# Altium project 1437_InclinometerPCB.PrjPCB
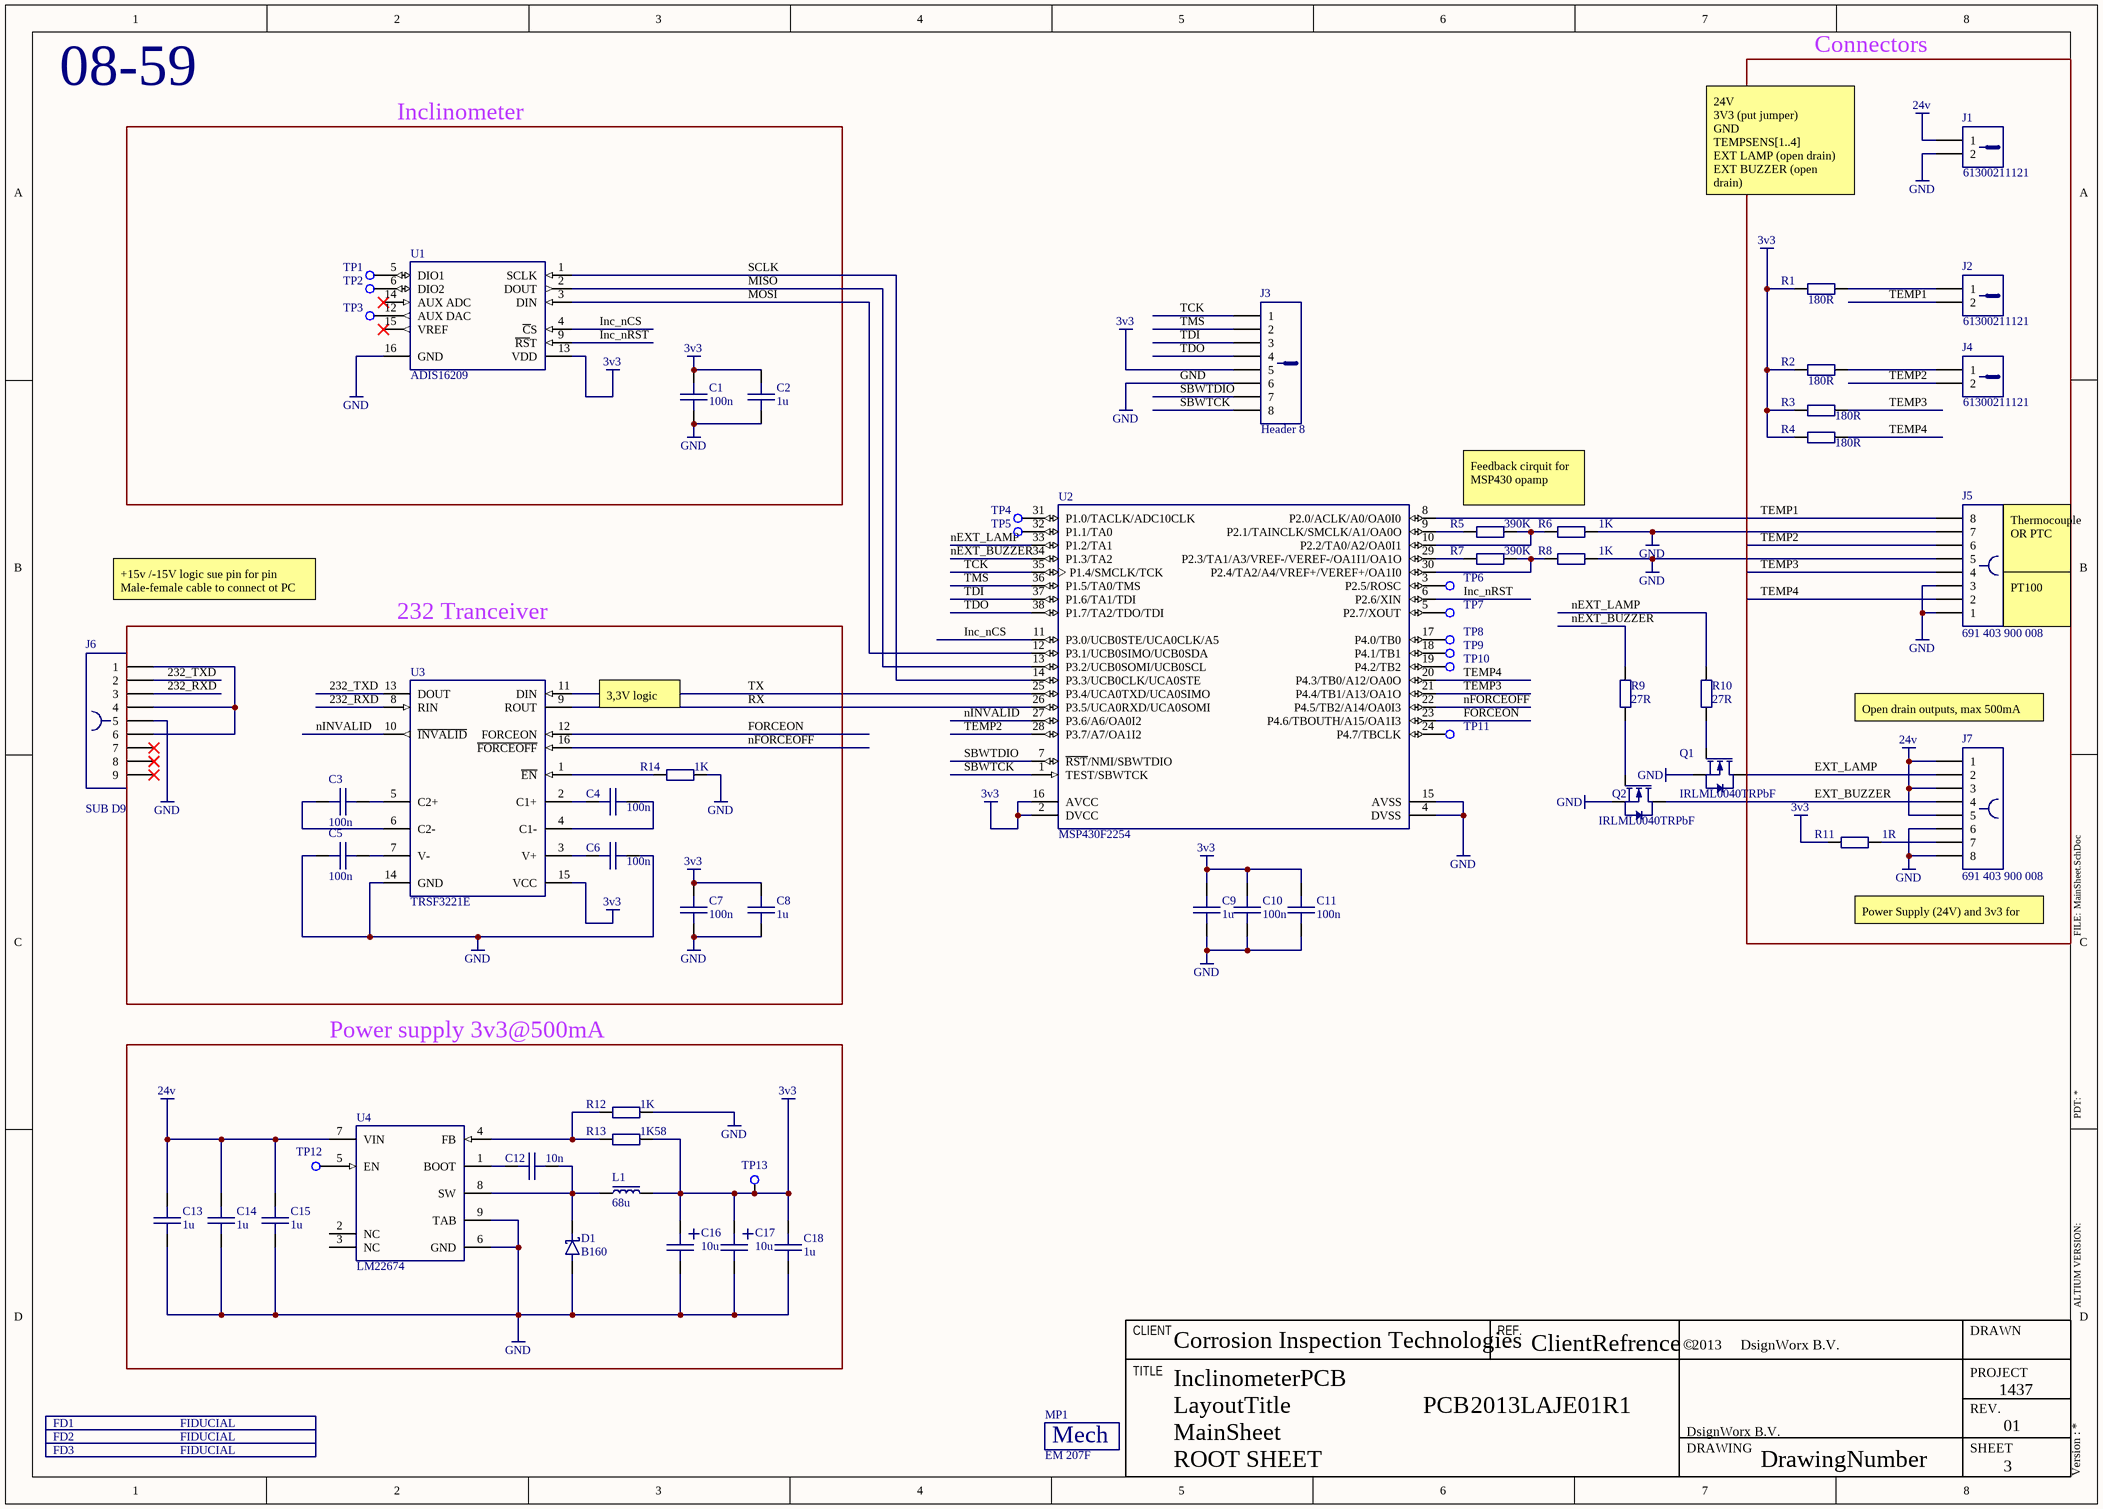
[diagram p0: MainSheet.SchDoc]
Client: Corrosion Inspection Technologies; ClientAddress-1: Amazone 194; ClientAddress-2: 3315WK; ClientAddress-3: DORDRECHT; ClientAddress-4: The Netherlands; ClientRefrence: ClientRefrence; DateApproved: DateApproved; DateChecked: DateChecked; DrawingNumber: DrawingNumber; EngApproved: EngApproved; EngChecked: EngChecked; EngProj: LAJE; GlobalRevision: 0; LayoutNr: 2013LAJE01R1; LayoutTitle: LayoutTitle; LayoutType: LayoutType; ProjName: InclinometerPCB; ProjNr: 1437; Year: 2013
1 sheet, 65 parts. Net scope: global (net labels, ports and power ports of the same name join across sheets).
Board file: InclinometerPCB.PcbDoc

## Sheet MainSheet.SchDoc
size A3; GlobalRevision: 01; DocumentNumber: 3; SheetNumber: 3; SheetTotal: 3; Eng: LAJE; DocumentType: ROOT SHEET; DocumentTitle: MainSheet; ProjNr: 1437

### Parts
?  (no value)  (graphical)
C1  Value1: 100n  [CAPC2012X88N]  (hidden comment: CAP)
C2  Value1: 1u  [CAPC2012X125N]  (hidden comment: CAP)
C3  Value1: 100n  [CAPC2012X88N]  (hidden comment: CAP)
C4  Value1: 100n  [CAPC2012X88N]  (hidden comment: CAP)
C5  Value1: 100n  [CAPC2012X88N]  (hidden comment: CAP)
C6  Value1: 100n  [CAPC2012X88N]  (hidden comment: CAP)
C7  Value1: 100n  [CAPC2012X88N]  (hidden comment: CAP)
C8  Value1: 1u  [CAPC2012X125N]  (hidden comment: CAP)
C9  Value1: 1u  [CAPC2012X125N]  (hidden comment: CAP)
C10  Value1: 100n  [CAPC2012X88N]  (hidden comment: CAP)
C11  Value1: 100n  [CAPC2012X88N]  (hidden comment: CAP)
C12  Value1: 10n  [CAPC2012X88N]  (hidden comment: CAP)
C13  Value1: 1u  [CAPC2012X125N]  (hidden comment: CAP)
C14  Value1: 1u  [CAPC2012X125N]  (hidden comment: CAP)
C15  Value1: 1u  [CAPC2012X125N]  (hidden comment: CAP)
C16  Value1: 10u  [CAPAE430X560N]  (hidden comment: CAP_POL)
C17  Value1: 10u  [CAPAE430X560N]  (hidden comment: CAP_POL)
C18  Value1: 1u  [CAPC2012X125N]  (hidden comment: CAP)
D1  Value1: B160  [DIOM5226X230N]  (hidden comment: DIO_SCHOTTKY)
FD1  Value1: FIDUCIAL  [FID100X200]  (hidden comment: MSC_FD)  (no BOM)
FD2  Value1: FIDUCIAL  [FID100X200]  (hidden comment: MSC_FD)  (no BOM)
FD3  Value1: FIDUCIAL  [FID100X200]  (hidden comment: MSC_FD)  (no BOM)
J1  Value1: 61300211121  [HDRV2W64P254_1X2_508X254X854P]  (hidden comment: CN_1X2M)
J2  Value1: 61300211121  [HDRV2W64P254_1X2_508X254X854P]  (hidden comment: CN_1X2M)
J3  Value1: Header 8  [CN_WURTH_613 00811121]  (hidden comment: CN_1X8M)
J4  Value1: 61300211121  [HDRV2W64P254_1X2_508X254X854P]  (hidden comment: CN_1X2M)
J5  Value1: 691 403 900 008  [CN_WURTH_691403900008]  (hidden comment: CN_1X8F)
J6  Value1: SUB D9  [DB_RA_R-9]  (hidden comment: CN_1X9F)
J7  Value1: 691 403 900 008  [CN_WURTH_691403900008]  (hidden comment: CN_1X8F)
L1  Value1: 68u  [IND_BOURNS_SDR0805]  (hidden comment: IND_CORE)
MP1  Value1: EM 207F  [MCH_BOPLA_EM207]  (hidden comment: MCH_MECHGENERIC)
Q1  Value1: IRLML0040TRPbF  [SOT95P237X112-3N]  (hidden comment: TRS_FETN_123)
Q2  Value1: IRLML0040TRPbF  [SOT95P237X112-3N]  (hidden comment: TRS_FETN_123)
R1  Value1: 180R  [RESC2012X60N]  (hidden comment: RES)
R2  Value1: 180R  [RESC2012X60N]  (hidden comment: RES)
R3  Value1: 180R  [RESC2012X60N]  (hidden comment: RES)
R4  Value1: 180R  [RESC2012X60N]  (hidden comment: RES)
R5  Value1: 390K  [RESC2012X60N]  (hidden comment: RES)
R6  Value1: 1K  [RESC2012X60N]  (hidden comment: RES)
R7  Value1: 390K  [RESC2012X60N]  (hidden comment: RES)
R8  Value1: 1K  [RESC2012X60N]  (hidden comment: RES)
R9  Value1: 27R  [RESC2012X60N]  (hidden comment: RES)
R10  Value1: 27R  [RESC2012X60N]  (hidden comment: RES)
R11  Value1: 1R  [RESC2012X60N]  (hidden comment: RES)
R12  Value1: 1K  [RESC2012X60N]  (hidden comment: RES)
R13  Value1: 1K58  [RESC2012X60N]  (hidden comment: RES)
R14  Value1: 1K  [RESC2012X60N]  (hidden comment: RES)
TP1  MSC_TP  [MSC_TP_THT1MM]  (value not drawn)  (no BOM)
TP2  MSC_TP  [MSC_TP_THT1MM]  (value not drawn)  (no BOM)
TP3  MSC_TP  [MSC_TP_THT1MM]  (value not drawn)  (no BOM)
TP4  MSC_TP  [MSC_TP_THT1MM]  (value not drawn)  (no BOM)
TP5  MSC_TP  [MSC_TP_THT1MM]  (value not drawn)  (no BOM)
TP6  MSC_TP  [MSC_TP_THT1MM]  (value not drawn)  (no BOM)
TP7  MSC_TP  [MSC_TP_THT1MM]  (value not drawn)  (no BOM)
TP8  MSC_TP  [MSC_TP_THT1MM]  (value not drawn)  (no BOM)
TP9  MSC_TP  [MSC_TP_THT1MM]  (value not drawn)  (no BOM)
TP10  MSC_TP  [MSC_TP_THT1MM]  (value not drawn)  (no BOM)
TP11  MSC_TP  [MSC_TP_THT1MM]  (value not drawn)  (no BOM)
TP12  MSC_TP  [MSC_TP_THT1MM]  (value not drawn)  (no BOM)
TP13  MSC_TP  [MSC_TP_THT1MM]  (value not drawn)  (no BOM)
U1  Value1: ADIS16209  [IC_ANALOG_ADIS16209]  (hidden comment: IC_ANALOG_ADIS16209)
U2  Value1: MSP430F2254  [SOP65P810X120-38N]  (hidden comment: IC_TI-MSP430F22X4-DA38)
U3  Value1: TRSF3221E  [SOP65P780X200-16L]  (hidden comment: IC_TI_TRSF3221E)
U4  Value1: LM22674  [SOIC127P600X168-9N]  (hidden comment: IC_TI_LM22674MR)

### Blocks framed on the sheet
Connectors: J1 J2 J4 J5 J7 R1-R4 R11
Inclinometer: C1 C2 TP1-TP3 U1
232 Tranceiver: C3-C8 J6 R14 U3
Power supply 3v3@500mA: C12-C18 D1 L1 R12 R13 TP12 TP13 U4

### Nets
3v3: C1.2 C2.2 C7.2 C8.2 C9.2 C10.2 C11.2 C16.1 C17.1 C18.2 J3.5 L1.2 R1.1 R2.1 R3.1 R4.1 R11.1 R13.1 TP13.1 U1.13(VDD) U2.2(DVCC) U2.16(AVCC) U3.15(VCC)
24v: C13.2 C14.2 C15.2 J1.1 J7.1 J7.3 J7.5 U4.7(VIN)
GND: C1.1 C2.1 C5.1 C6.2 C7.1 C8.1 C9.1 C10.1 C11.1 C13.1 C14.1 C15.1 C16.2 C17.2 C18.1 D1.2(A) J1.2 J3.6 J5.1 J5.3 J5.5 J5.7 J6.5 J7.6 J7.8 Q1.2(S) Q2.2(S) R6.2 R8.2 R12.2 R14.2 U1.16(GND) U2.4(DVSS) U2.15(AVSS) U3.14(GND) U4.6(GND) U4.9(TAB)
232_RXD: J6.3 U3.8(RIN)
232_TXD: J6.2 U3.13(DOUT)
EXT_BUZZER: J7.4 Q2.3(D)
EXT_LAMP: J7.2 Q1.3(D)
FORCEON: U2.23(P4.6/TBOUTH/A15/OA1I3) U3.12(FORCEON)
Inc_nCS: U1.4(~{C}S) U2.11(P3.0/UCB0STE/UCA0CLK/A5)
Inc_nRST: U1.9(~{RS}T) U2.6(P2.6/XIN)
MISO: U1.2(DOUT) U2.13(P3.2/UCB0SOMI/UCB0SCL)
MOSI: U1.3(DIN) U2.12(P3.1/UCB0SIMO/UCB0SDA)
nEXT_BUZZER: R9.2 U2.34(P1.3/TA2)
nEXT_LAMP: R10.2 U2.33(P1.2/TA1)
nFORCEOFF: U2.22(P4.5/TB2/A14/OA0I3) U3.16(~{FORCEOFF})
nINVALID: U2.27(P3.6/A6/OA0I2) U3.10(~{INVALID})
RX: U2.26(P3.5/UCA0RXD/UCA0SOMI) U3.9(ROUT)
SBWTCK: J3.8 U2.1(TEST/SBWTCK)
SBWTDIO: J3.7 U2.7(~{RST}/NMI/SBWTDIO)
SCLK: U1.1(SCLK) U2.14(P3.3/UCB0CLK/UCA0STE)
TCK: J3.1 U2.35(P1.4/SMCLK/TCK)
TDI: J3.3 U2.37(P1.6/TA1/TDI)
TDO: J3.4 U2.38(P1.7/TA2/TDO/TDI)
TEMP1: J2.2 J5.8 U2.8(P2.0/ACLK/A0/OA0I0)
TEMP2: J4.2 J5.6 U2.28(P3.7/A7/OA1I2)
TEMP3: J5.4 R3.2 U2.21(P4.4/TB1/A13/OA1O)
TEMP4: J5.2 R4.2 U2.20(P4.3/TB0/A12/OA0O)
TMS: J3.2 U2.36(P1.5/TA0/TMS)
TX: U2.25(P3.4/UCA0TXD/UCA0SIMO) U3.11(DIN)
NetC3_1: C3.1 U3.5(C2+)
NetC3_2: C3.2 U3.6(C2-)
NetC4_1: C4.1 U3.4(C1-)
NetC4_2: C4.2 U3.2(C1+)
NetC5_2: C5.2 U3.7(V-)
NetC6_1: C6.1 U3.3(V+)
NetC12_1: C12.1 U4.1(BOOT)
NetC12_2: C12.2 D1.1(K) L1.1 U4.8(SW)
NetJ2_1: J2.1 R1.2
NetJ4_1: J4.1 R2.2
NetJ6_1: J6.1 J6.4 J6.6
NetJ7_7: J7.7 R11.2
NetQ1_1: Q1.1(G) R10.1
NetQ2_1: Q2.1(G) R9.1
NetR5_1: R5.1 U2.9(P2.1/TAINCLK/SMCLK/A1/OA0O)
NetR5_2: R5.2 R6.1 U2.10(P2.2/TA0/A2/OA0I1)
NetR7_1: R7.1 U2.29(P2.3/TA1/A3/VREF-/VEREF-/OA1I1/OA1O)
NetR7_2: R7.2 R8.1 U2.30(P2.4/TA2/A4/VREF+/VEREF+/OA1I0)
NetR12_1: R12.1 R13.2 U4.4(FB)
NetR14_1: R14.1 U3.1(~{EN})
NetTP1_1: TP1.1 U1.5(DIO1)
NetTP2_1: TP2.1 U1.6(DIO2)
NetTP3_1: TP3.1 U1.12(AUX_DAC)
NetTP4_1: TP4.1 U2.31(P1.0/TACLK/ADC10CLK)
NetTP5_1: TP5.1 U2.32(P1.1/TA0)
NetTP6_1: TP6.1 U2.3(P2.5/ROSC)
NetTP7_1: TP7.1 U2.5(P2.7/XOUT)
NetTP8_1: TP8.1 U2.17(P4.0/TB0)
NetTP9_1: TP9.1 U2.18(P4.1/TB1)
NetTP10_1: TP10.1 U2.19(P4.2/TB2)
NetTP11_1: TP11.1 U2.24(P4.7/TBCLK)
NetTP12_1: TP12.1 U4.5(EN)

Not connected (* = marked no-connect by the designer): J6 7* 8* 9*; U1 14(AUX_ADC)* 15(VREF)*; U4 2(NC) 3(NC)

### Notes on the sheet
- 08-59
- 24V
  3V3 (put jumper)
  GND
  TEMPSENS[1..4]
  EXT LAMP (open drain)
  EXT BUZZER (open drain)
- Feedback cirquit for MSP430 opamp
- (near J5) Thermocouple OR PTC
- +15v /-15V logic sue pin for pin Male-female cable to connect ot PC
- (near J5) PT100
- 3,3V logic
- (near J7) Open drain outputs, max 500mA
- Power Supply (24V) and 3v3 for external use
- FILE:
- PDT:
- ALTIUM VERSION:
- CLIENT
- TITLE
- REF.
- ©
- DsignWorx B.V.
- DRAWN
- PROJECT
- PCB
- DRAWING
- REV.
- SHEET
- Version :
- (in symbol 09_00002) Mech

### Library data of the parts
? = DSW_TitleBlockSheetn
C1 C3-C7 C10 C11 = 01_00637: X7R 10% 0805; Manufacturer: KEMET; Manufacturer PN: C0805C104K9RACTU; Value2: 6.3v; DeviceType: capacitor; SubType: ceramic; Id: 01_00637; Status: 2; MountType: SMD; ComponentLink1Description: Datasheet; ComponentLink1URL: X:\01_Datasheets\CAP_KEMET_CxxxxCxxxXxRAC.pdf; ComponentLink2Description: ComponentVerificationSheet; ComponentLink2URL: X:\02_ComponentVerificationSheets\CAP_KEMET_CxxxxCxxxXxRAC_ComponentVerificationSheet.xlsx; Supplier 1: Mouser; Supplier Part Number 1: 80-C0805C104K9R
C2 C8 C9 C13-C15 C18 = 01_01396: X7R 10% 0805; Manufacturer: KEMET; Manufacturer PN: C0805C105K5RACTU; Value2: 50v; DeviceType: capacitor; SubType: ceramic; Id: 01_01396; Status: 2; MountType: SMD; ComponentLink1Description: Datasheet; ComponentLink1URL: X:\01_Datasheets\CAP_KEMET_CxxxxCxxxXxRAC.pdf; ComponentLink2Description: ComponentVerificationSheet; ComponentLink2URL: X:\02_ComponentVerificationSheets\CAP_KEMET_CxxxxCxxxXxRAC_ComponentVerificationSheet.xlsx; Supplier 1: Farnell; Supplier Part Number 1: 2118131
C12 = 01_00880: X7R 10% 0805; Manufacturer: KEMET; Manufacturer PN: C0805C103K5RACTU; Value2: 50v; DeviceType: capacitor; SubType: ceramic; Id: 01_00880; Status: 2; MountType: SMD; ComponentLink1Description: Datasheet; ComponentLink1URL: X:\01_Datasheets\CAP_KEMET_CxxxxCxxxXxRAC.pdf; ComponentLink2Description: ComponentVerificationSheet; ComponentLink2URL: X:\02_ComponentVerificationSheets\CAP_KEMET_CxxxxCxxxXxRAC_ComponentVerificationSheet.xlsx; Supplier 1: Farnell; Supplier Part Number 1: 1414662
C16 C17 = 01_01399: ALUMINUM ELECTROLYTIC CAPACITORS; Manufacturer: Nichicon; Manufacturer PN: UWF1C100MCL1GB; Value2: 16V; Id: 01_01399; DeviceType: capacitor; Status: 0; MountType: SMT; ComponentLink1Description: Datasheet; ComponentLink1URL: X:\01_Datasheets\CAP_NICHICON_UWF1C100MCL1GB.pdf; ComponentLink2Description: ComponentVerificationSheet; ComponentLink2URL: X:\02_ComponentVerificationSheets\CAP_NICHICON_UWF1C100MCL1GB_ComponentVerificationSheet.xlsx; Supplier 1: Mouser; Supplier Part Number 1: 647-UWF1C100MCL1GB
D1 = 03_00002: DIODES INC. - B160-13-F - DIODE,SCHOTTKY, 60V, 1A, SMA; Id: 03_00002; Manufacturer: DIODES INC; Manufacturer PN: B160-13-F; DeviceType: diode; SubType: schottky; Status: 2; MountType: SMT; ComponentLink1Description: Datasheet; ComponentLink1URL: X:\01_Datasheets\DIO_DIODES_B160B.pdf; ComponentLink2Description: ComponentVerificationSheet; ComponentLink2URL: X:\02_ComponentVerificationSheets\DIO_DIODES_B160_ComponentVerificationSheet.xlsx; Supplier 1: Farnell; Supplier Part Number 1: 1843674
FD1-FD3 = 12_00002: Value2: NO BUY; DeviceType: misc; Id: 12_00002; Status: 0; MountType: SMT; ComponentLink1Description: Datasheet; ComponentLink1URL: X:\01_Datasheets\; ComponentLink2Description: ComponentVerificationSheet; ComponentLink2URL: X:\02_ComponentVerificationSheets\
J1 J2 J4 = 02_00008: 2 pin male pin header Pitch2.54; Manufacturer: Wurth Electronics; DeviceType: Connector_2; Id: 02_00008; Manufacturer PN: 61300211121; SubType: header; Status: 2; MountType: THT; ComponentLink1Description: Datasheet; ComponentLink1URL: X:\01_Datasheets\CN_WURTH_613 0xx 111 21.pdf; ComponentLink2Description: ComponentVerificationSheet; ComponentLink2URL: X:\02_ComponentVerificationSheets\CN_WURTH_613 0xx 111 21_ComponentVerificationSheet.xlsx; Supplier 1: Mouser; Supplier Part Number 1: 710-61300211121
J3 = 02_00012: 2.54mm Pin Header WR-PHD; Manufacturer: Wurth Electronics; Manufacturer PN: 613 00811121; DeviceType: Connector_8; Id: 02_00012; Status: 2; MountType: THT; ComponentLink1Description: Datasheet; ComponentLink1URL: X:\01_Datasheets\CN_WURTH_613 0xx 111 21.pdf; ComponentLink2Description: ComponentVerificationSheet; ComponentLink2URL: X:\02_ComponentVerificationSheets\CN_WURTH_61300811121_ComponentVerificationSheet.xlsx; Supplier 1: Farnell; Supplier Part Number 1: 1841229
J5 J7 = 02_00011: Serie 4039 B - 2.54mm m. vertikalem Kabeleingang - 0.5mm² Draht WR-TBL; Manufacturer: Wurth Electronics; Manufacturer PN: 691403900008; DeviceType: Connector_8; SubType: Terminal Block; Id: 02_00011; Status: 0; MountType: SMT; ComponentLink1Description: Datasheet; ComponentLink1URL: X:\01_Datasheets\CN_WURTH_691 403 900 008.pdf; ComponentLink2Description: ComponentVerificationSheet; ComponentLink2URL: X:\02_ComponentVerificationSheets\CN_WURTH_691403900008_ComponentVerificationSheet.xlsx; Supplier 1: WURTH; Supplier Part Number 1: 691403900008
J6 = 02_00004: Receptacle Through Hole Right Angle; Manufacturer: MULTICOMP; Manufacturer PN: 5504F1-09S-02A-03; DeviceType: Connector_9; Id: 02_00004; Value2: Receptacle; Status: 1; MountType: THT; ComponentLink1Description: Datasheet; ComponentLink1URL: CN_MULTI_5504F1-09S-02A-03.pdf; ComponentLink2Description: ComponentVerificationSheet; ComponentLink2URL: X:\02_ComponentVerificationSheets\CN_MULTI_5504F1-09S-02A-03_ComponentVerificationSheet.xlsx; Supplier 1: Farnell; Supplier Part Number 1: 1848372
L1 = 08_00002: BOURNS - SDR0805-680KL - INDUCTOR, SMD, 68UH, 1.3A; Value2: 850mA; SubType: power; Id: 08_00002; Manufacturer: Bourns; Manufacturer PN: SDR0805-680KL; DeviceType: inductor; Status: 2; MountType: SMT; ComponentLink1Description: Datasheet; ComponentLink1URL: X:\01_Datasheets\IND_BOURNS_SDR0805.pdf; ComponentLink2Description: ComponentVerificationSheet; ComponentLink2URL: X:\02_ComponentVerificationSheets\IND_BOURNS_SDR0805_ComponentVerificationSheet.xls; Supplier 1: Farnell; Supplier Part Number 1: 1828031
MP1 = 09_00002: BOPLA - 63207400 - CASE, PLASTIC, EUROMAS 2; DeviceType: Housing; Id: 09_00002; Manufacturer: BOPLA; Manufacturer PN: 63207400; Status: 0; ComponentLink1Description: Datasheet; ComponentLink1URL: X:\01_Datasheets\MCH_BOPLA_EM207F.pdf; ComponentLink2Description: ComponentVerificationSheet; ComponentLink2URL: X:\02_ComponentVerificationSheets\; Supplier 1: Farnell; Supplier Part Number 1: 1217465
Q1 Q2 = 19_00001: INTERNATIONAL RECTIFIER - IRLML0040TRPBF - MOSFET & DIODE,N CH,40V,3.6A,SOT23; Value2: 40v 3.6A; DeviceType: transistor; SubType: FET N; Id: 19_00001; Manufacturer: INTERNATIONAL RECTIFIER; Manufacturer PN: IRLML0040TRPBF; Status: 2; MountType: SMT; ComponentLink1Description: Datasheet; ComponentLink1URL: X:\01_Datasheets\TRS_IR_IRLML0040TRPbF.pdf; ComponentLink2Description: ComponentVerificationSheet; ComponentLink2URL: X:\02_ComponentVerificationSheets\TRS_IR_IRLML0040TRPbF_ComponentVerificationSheet.xlsx; Supplier 1: Farnell; Supplier Part Number 1: 1831088
R1-R4 = 15_00320: 1% SMT Resistor 0805; Manufacturer: YAGEO; Manufacturer PN: RC0805FR-07180R; Value2: 0.125w; SubType: Film; Id: 15_00320; DeviceType: resistor; Status: 2; MountType: SMD; ComponentLink1Description: Datasheet; ComponentLink1URL: X:\01_Datasheets\RES_YAGEO_RC0805FR.pdf; ComponentLink2Description: ComponentVerificationSheet; ComponentLink2URL: X:\02_ComponentVerificationSheets\RES_YAGEO_RC0805FR_ComponentVerificationSheet.xlsx; Supplier 1: Farnell; Supplier Part Number 1: 9237399
R5 R7 = 15_00360: 1% SMT Resistor 0805; Manufacturer: YAGEO; Manufacturer PN: RC0805FR-07390K; Value2: 0.125w; SubType: Film; Id: 15_00360; DeviceType: resistor; Status: 2; MountType: SMD; ComponentLink1Description: Datasheet; ComponentLink1URL: X:\01_Datasheets\RES_YAGEO_RC0805FR.pdf; ComponentLink2Description: ComponentVerificationSheet; ComponentLink2URL: X:\02_ComponentVerificationSheets\RES_YAGEO_RC0805FR_ComponentVerificationSheet.xlsx; Supplier 1: Farnell; Supplier Part Number 1: 9237941
R6 R8 R12 R14 = 15_00329: 1% SMT Resistor 0805; Manufacturer: YAGEO; Manufacturer PN: RC0805FR-071K; Value2: 0.125w; SubType: Film; Id: 15_00329; DeviceType: resistor; Status: 2; MountType: SMD; ComponentLink1Description: Datasheet; ComponentLink1URL: X:\01_Datasheets\RES_YAGEO_RC0805FR.pdf; ComponentLink2Description: ComponentVerificationSheet; ComponentLink2URL: X:\02_ComponentVerificationSheets\RES_YAGEO_RC0805FR_ComponentVerificationSheet.xlsx; Supplier 1: Farnell; Supplier Part Number 1: 9237496
R9 R10 = 15_00310: 1% SMT Resistor 0805; Manufacturer: YAGEO; Manufacturer PN: RC0805FR-0727R; Value2: 0.125w; SubType: Film; Id: 15_00310; DeviceType: resistor; Status: 2; MountType: SMD; ComponentLink1Description: Datasheet; ComponentLink1URL: X:\01_Datasheets\RES_YAGEO_RC0805FR.pdf; ComponentLink2Description: ComponentVerificationSheet; ComponentLink2URL: X:\02_ComponentVerificationSheets\RES_YAGEO_RC0805FR_ComponentVerificationSheet.xlsx; Supplier 1: Farnell; Supplier Part Number 1: 9237291
R11 = 15_00293: 1% SMT Resistor 0805; Manufacturer: YAGEO; Manufacturer PN: RC0805FR-071R; Value2: 0.125w; SubType: Film; Id: 15_00293; DeviceType: resistor; Status: 0; MountType: SMD; ComponentLink1Description: Datasheet; ComponentLink1URL: X:\01_Datasheets\RES_YAGEO_RC0805FR.pdf; ComponentLink2Description: ComponentVerificationSheet; ComponentLink2URL: X:\02_ComponentVerificationSheets\RES_YAGEO_RC0805FR_ComponentVerificationSheet.xlsx; Supplier 1: Farnell; Supplier Part Number 1: 9237135
R13 = 15_00439: PANASONIC - ERJ-6ENF1581V - RESISTOR, THICK FILM, 1.58KOHM, 125mW, ± 1%; Value2: 0.125W; Id: 15_00439; Manufacturer: PANASONIC; Manufacturer PN: ERJ-6ENF1581V; DeviceType: resistor; Status: 2; MountType: SMT; ComponentLink1Description: Datasheet; ComponentLink1URL: X:\01_Datasheets\RES_PANASONIC_ERJ.pdf; ComponentLink2Description: ComponentVerificationSheet; ComponentLink2URL: X:\02_ComponentVerificationSheets\RES_PANASONIC_ERJ_ComponentVerificationSheet.xlsx; Supplier 1: Farnell; Supplier Part Number 1: 2283260
TP1-TP13 = 12_00001: With Hole for 1 header pin; Value1: TESTPOINT; Value2: NO BUY; Id: 12_00001; Status: 0; MountType: THT; ComponentLink1Description: Datasheet; ComponentLink1URL: X:\01_Datasheets\; ComponentLink2Description: ComponentVerificationSheet; ComponentLink2URL: X:\02_ComponentVerificationSheets\
U1 = 07_00012: High Accuracy, Dual-Axis Digital Inclinometer and Accelerometer; Manufacturer: Analog devices; Manufacturer PN: ADIS16209CCCZ; SubType: Sensor; Id: 07_00012; DeviceType: ADIS16209; Status: 2; MountType: SMD; ComponentLink1Description: Datasheet; ComponentLink1URL: X:\01_DataSheets\IC_ANALOG_ADIS16209.pdf; ComponentLink2Description: ComponentVerificationSheet; ComponentLink2URL: X:\02_ComponentVerificationSheets\IC_ANALOG_ADIS16209_ComponentVerificationSheet.xlsx; Supplier 1: Farnell; Supplier Part Number 1: 1607244
U2 = 07_00011: TEXAS INSTRUMENTS - MSP430F2254IDA - IC, MCU, 16BIT, 16K FLASH, 38TSSOP; Manufacturer: TI; SubType: Microcontroller; Id: 07_00011; Manufacturer PN: MSP430F2254IDA; DeviceType: MSP430F2254IDA; Status: 2; MountType: SMD; ComponentLink1Description: Datasheet; ComponentLink1URL: X:\01_DataSheets\IC_TI_MSP430F22x4.pdf; ComponentLink2Description: ComponentVerificationSheet; ComponentLink2URL: X:\02_ComponentVerificationSheets\IC_TI_MSP430F2254_ComponentVerificationSheet.xlsx; Supplier 1: Farnell; Supplier Part Number 1: 1649422
U3 = 07_00013: 3-V TO 5.5-V SINGLE-CHANNEL RS-232 1-Mbit/s LINE DRIVER/RECEIVER; Manufacturer: TI; Manufacturer PN: TRSF3221ECDB; SubType: level shifter; Id: 07_00013; DeviceType: TRSF3221ECDB; Status: 2; MountType: SMD; ComponentLink1Description: Datasheet; ComponentLink1URL: X:\01_DataSheets\IC_TI_TRSF3221E.pdf; ComponentLink2Description: ComponentVerificationSheet; ComponentLink2URL: X:\02_ComponentVerificationSheets\IC_TI_TRSF3221E_ComponentVerificationSheet.xlsx; Supplier 1: Farnell; Supplier Part Number 1: 1755598
U4 = 07_00014: TEXAS INSTRUMENTS - LM22674MR-ADJ - REGULATOR, ADJ. VOLTAGE, 0.5A 8PSOP; Manufacturer: TI; SubType: SMPS; Id: 07_00014; Manufacturer PN: LM22674MR-ADJ; DeviceType: LM22674; Status: 2; MountType: SMT; ComponentLink1Description: Datasheet; ComponentLink1URL: X:\01_Datasheets\IC_TI_LM22674.pdf; ComponentLink2Description: ComponentVerificationSheet; ComponentLink2URL: X:\02_ComponentVerificationSheets\IC_TI_LM22674_ComponentVerificationSheet.xlsx; Supplier 1: Farnell; Supplier Part Number 1: 1657737